# EasyEDA schematic 1-Schematic.json
TITLE: Aguhajsu 1S/3A; REV: 1.0; Date: 2020-09-16; Sheet: 1/1; Drawn By: tardate; Company: leap.tardate.com
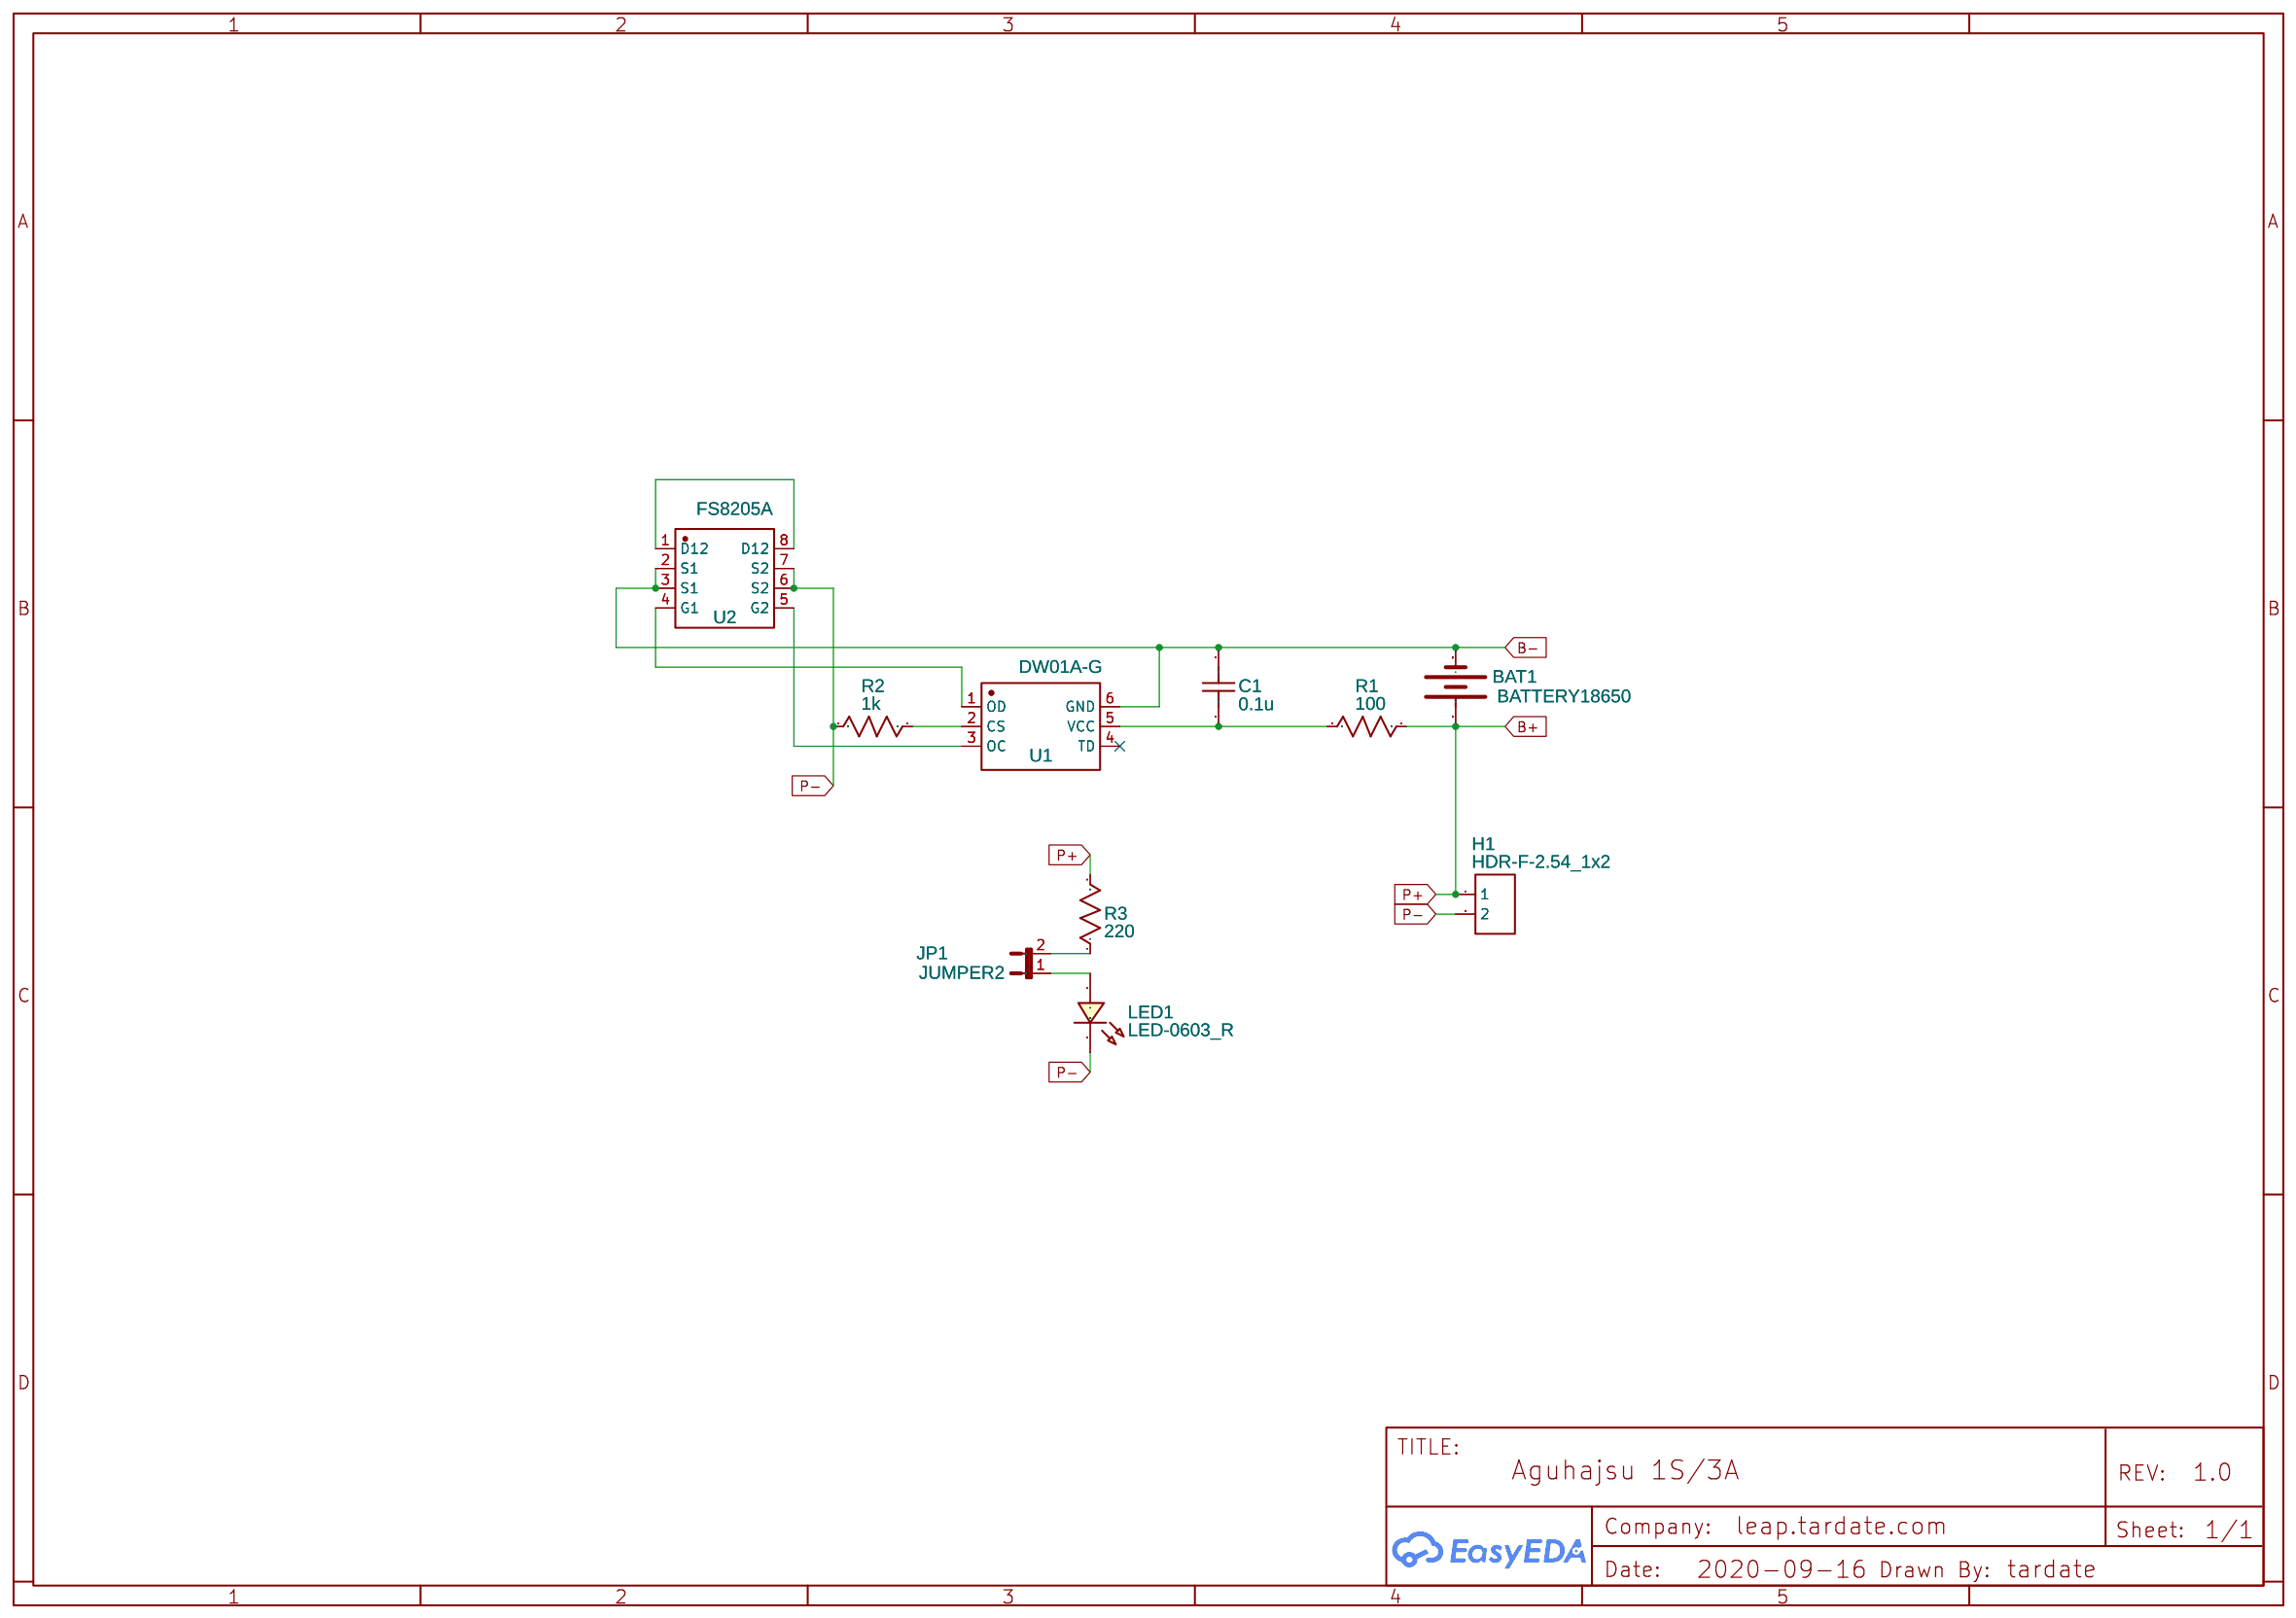
[diagram p0: schematic sheet]

## Parts
BAT1  BATTERY18650  [BATTERY_18650-HOLDER]
C1  0.1u  [C0603]
H1  HDR-F-2.54_1x2  [HDR-F-2.54_1X2]
JP1  JUMPER2  [JUMPER2]
LED1  LED-0603_R  [LED0603_RED]
R1  100  [R0603]
R2  1k  [R0603]
R3  220  [R0603]
U1  DW01A-G  [SOT-23-6_L2.9-W1.6-P0.95-LS2.8-BR]
U2  FS8205A  [TSSOP-8_L4.4-W3.5-P0.65-LS6.4-BL]

## Library data of the parts
BAT1 = BATTERY18650: Battery Holders; Contributor: SparkFun
C1 = C_0603_US: Contributor: LCEDA_Lib
H1 = HDR-F-2.54_1x2: Supplier Part: C49661; Supplier: LCSC; Contributor: LCEDA_Lib
JP1 = JUMPER2: Jumper 2 Pin; Contributor: PatternAgents
LED1 = LED-0603_R: Manufacturer: EVERLIGHT(台湾亿光); Manufacturer Part: 19-217/R6C-AL1M2VY/3T; Supplier Part: C72044; Supplier: LCSC; Contributor: LCEDA_01
R1-R3 = R_0603_US: Contributor: LCEDA_Lib
U1 = DW01A-G: Supplier: LCSC; Manufacturer: FORTUNE; Contributor: LCSC; Supplier Part: C61503; LCSC Assembly: Yes; SMT Type: Extend
U2 = FS8205A: Supplier: LCSC; Manufacturer: FORTUNE; LCSC Assembly: Yes; image: //image.lceda.cn/szlcsc/C16052.jpg; Supplier Part: C16052; SMT Type: Basic

## Nets
B+: BAT1.PWR@1(+) H1.1 R1.1 R3.2
B-: BAT1.GND@1(-) C1.1 U1.6(GND) U2.2(S1) U2.3(S1)
P-: H1.2 LED1.2 R2.2 U2.6(S2) U2.7(S2)
Net-(C1-2): C1.2 R1.2 U1.5(VCC)
Net-(JP1-1): JP1.1 LED1.1
Net-(JP1-2): JP1.2 R3.1
Net-(R2-1): R2.1 U1.2(CS)
Net-(U1-1): U1.1(OD) U2.4(G1)
Net-(U1-3): U1.3(OC) U2.5(G2)
Net-(U2-1): U2.1(D12) U2.8(D12)

Not connected (* = marked no-connect by the designer): U1 4(TD)*
